# Altium schematic sheet PressureSensorsMain.SchDoc
size A
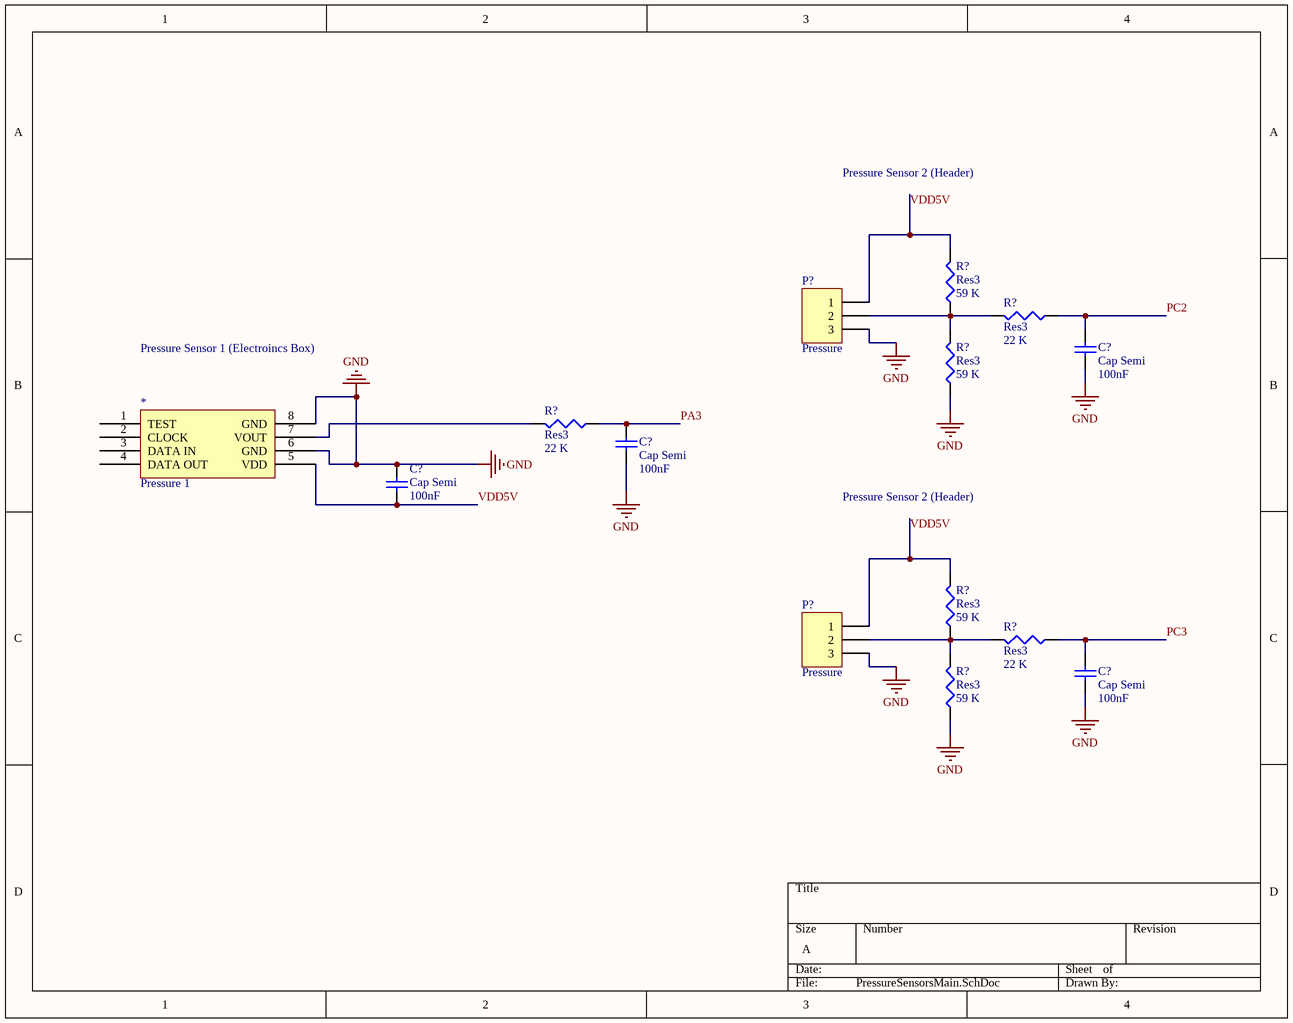
[diagram p0: PressureSensorsMain.SchDoc]

## Parts
(Parts that share a designator on the sheet are numbered #1, #2 ... from top to bottom, then left to right.)
*  Pressure 1
C?#1  Cap Semi  value 100nF  [C1206]
C?#2  Cap Semi  value 100nF  [C1206]
C?#3  Cap Semi  value 100nF  [C1206]
C?#4  Cap Semi  value 100nF  [C1206]
P?#1  Pressure  [HDR1X3]
P?#2  Pressure  [HDR1X3]
R?#1  Res3  value 59 K  [14-1210]
R?#2  Res3  value 22 K  [14-1210]
R?#3  Res3  value 59 K  [14-1210]
R?#4  Res3  value 22 K  [14-1210]
R?#5  Res3  value 59 K  [14-1210]
R?#6  Res3  value 22 K  [14-1210]
R?#7  Res3  value 59 K  [14-1210]

## Nets
GND: *.6(GND) *.8(GND) C?#1.1 C?#2.1 C?#3.2 C?#4.1 P?#1.3 P?#2.3 R?#3.1 R?#7.1
PA3: C?#2.2 R?#4.1
PC2: C?#1.2 R?#2.1
PC3: C?#4.2 R?#6.1
VDD5V: *.5(VDD) C?#3.1 P?#1.1 P?#2.1 R?#1.2 R?#5.2
Net*_7: *.7(VOUT) R?#4.2
NetP?#1_2: P?#1.2 R?#1.1 R?#2.2 R?#3.2
NetP?#2_2: P?#2.2 R?#5.1 R?#6.2 R?#7.2

Not connected (* = marked no-connect by the designer): * 1(TEST) 2(CLOCK) 3(DATA_IN) 4(DATA_OUT)

## Notes on the sheet
- Pressure Sensor 2 (Header)
- Pressure Sensor 1 (Electroincs Box)

## Library data of the parts
* = Component_1
C?#1-C?#4 = Cap Semi: Capacitor (Semiconductor SIM Model); Published: 8-Jun-2000; LatestRevisionDate: 29-May-2009; LatestRevisionNote: IPC-7351 Footprint Added.; PackageReference: C1206; Publisher: Altium Limited; PackageDescription: Chip Capacitor
P?#1 P?#2 = Header 3: Header, 3-Pin; LatestRevisionDate: 17-Jul-2002; LatestRevisionNote: Re-released for DXP Platform.; Publisher: Altium Limited
R?#1-R?#7 = Res3: Resistor; Published: 8-Jun-2000; LatestRevisionDate: 29-May-2009; LatestRevisionNote: IPC-7351 Footprint Added.; PackageReference: J1-0603; Publisher: Altium Limited; PackageDescription: Chip Resistor